# EAGLE design ByteBlasterII (EAGLE 6.6.0)
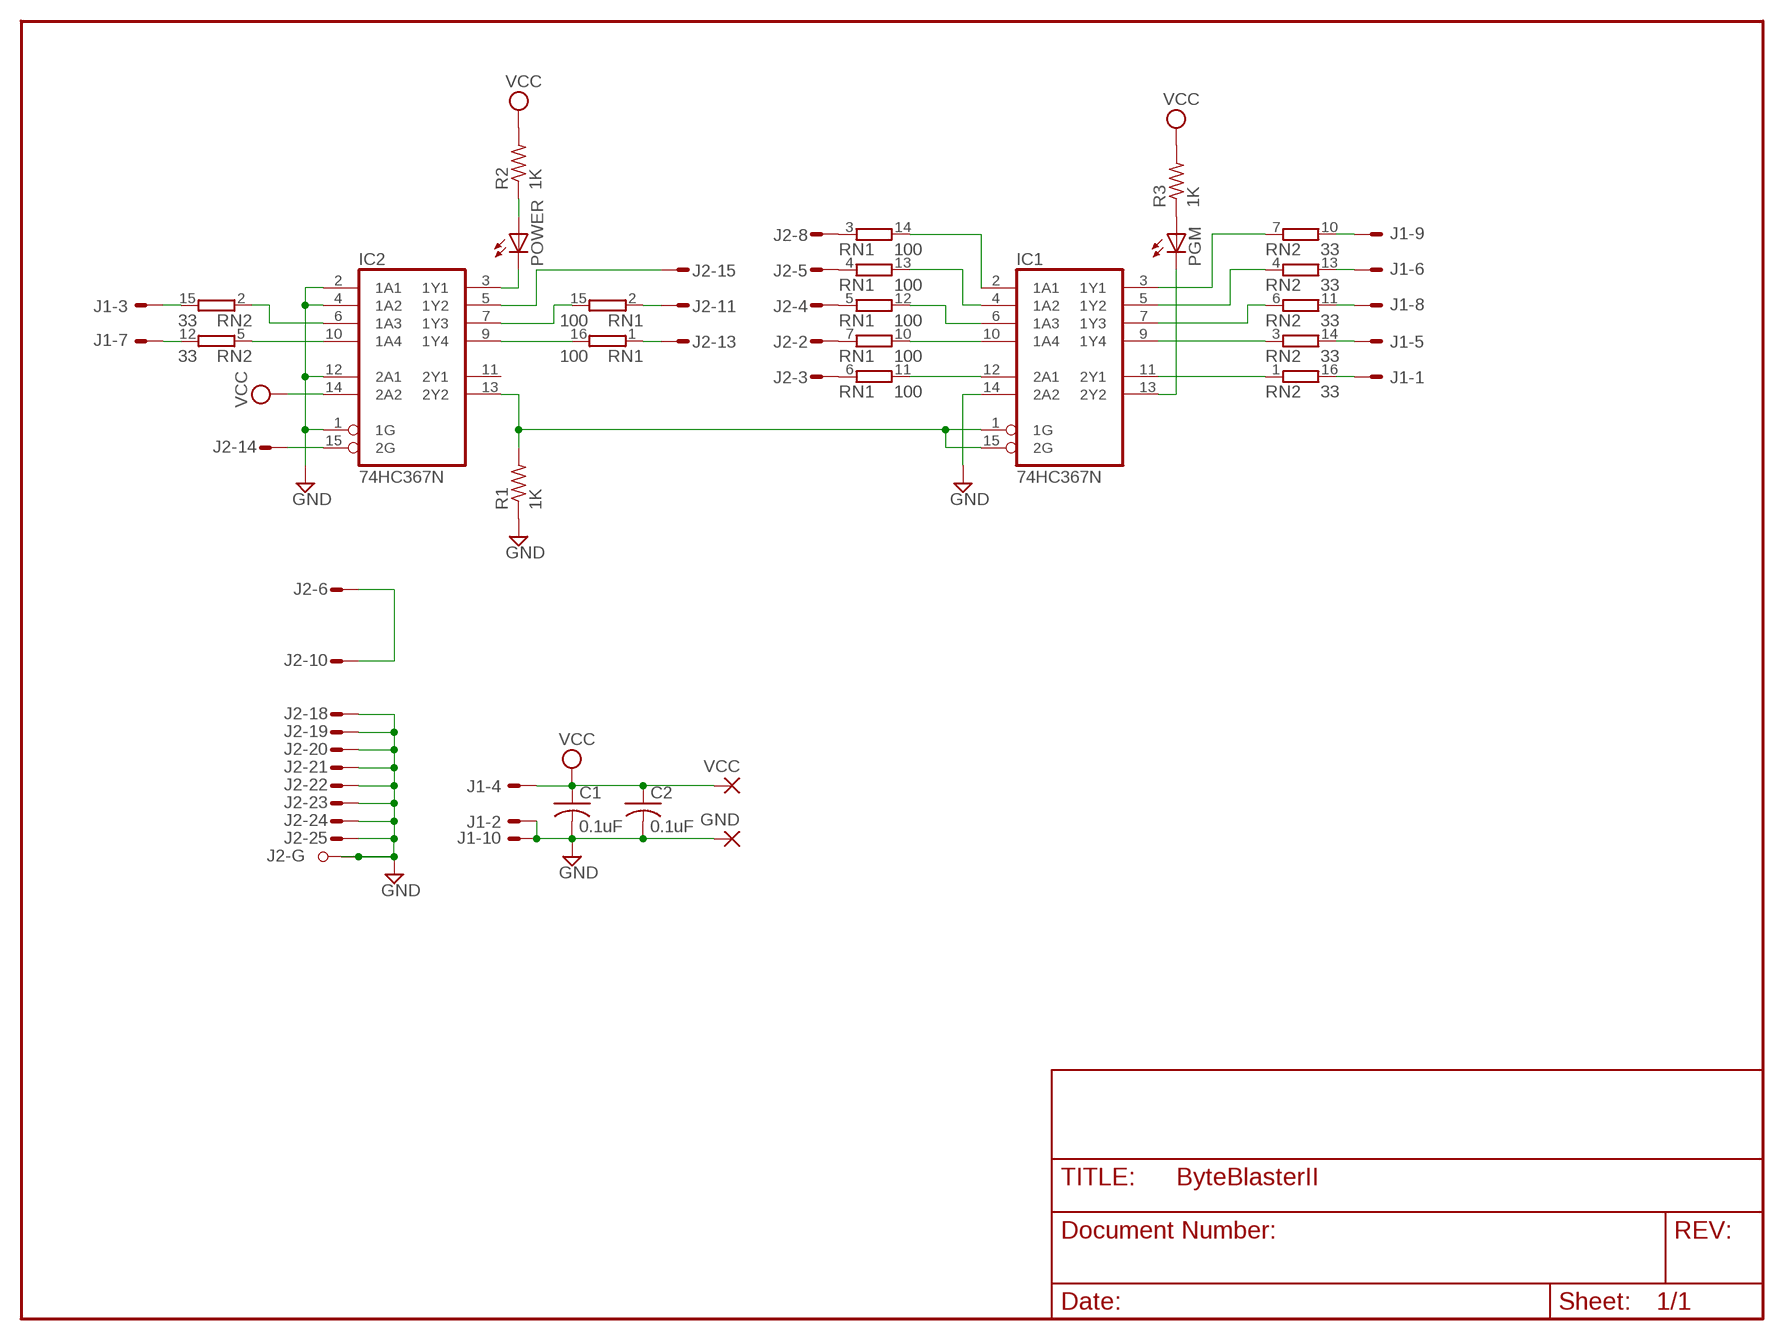
[diagram p0: schematic, sheet 1]

## Parts
C1  0.1uF  C-US050-025X075  [C050-025X075]
C2  0.1uF  C-US050-025X075  [C050-025X075]
GND  1,6/0,9  [1,6/0,9]
IC1  74HC367N  [DIL16]
IC2  74HC367N  [DIL16]
J1  ML10E  [ML10]
J2  M25VPS  [M25VP]
PGM  LED3MM  [LED3MM]
POWER  LED3MM  [LED3MM]
R1  1K  R-US_0207/10  [0207/10]
R2  1K  R-US_0207/10  [0207/10]
R3  1K  R-US_0207/10  [0207/10]
RN1  100  8R-P  [DIL16]
RN2  33  8R-P  [DIL16]
VCC  1,6/0,9  [1,6/0,9]

## Nets
GND [supply]: C1.2 C2.2 GND.1(P) IC1.14(2A2) IC2.1(1G) IC2.2(1A1) IC2.4(1A2) IC2.12(2A1) J1.2 J1.10 J2.18(-18:M) J2.19(-19:M) J2.20(-20:M) J2.21(-21:M) J2.22(-22:M) J2.23(-23:M) J2.24(-24:M) J2.25(-25:M) J2.G1(-G:G1) J2.G2(-G:G2) R1.1
N$1: J1.6 RN2.13
N$2: J1.8 RN2.11
N$3: J2.8(-8:M) RN1.3
N$4: J2.5(-5:M) RN1.4
N$5: J1.5 RN2.14
N$6: J1.9 RN2.10
N$7: J2.4(-4:M) RN1.5
N$8: IC1.10(1A4) RN1.10
N$9: J2.6(-6:M) J2.10(-10:M)
N$10: J2.3(-3:M) RN1.6
N$11: IC1.4(1A2) RN1.13
N$12: J2.13(-13:M) RN1.1
N$13: J1.1 RN2.16
N$14: J2.11(-11:M) RN1.2
N$15: IC1.1(1G) IC1.15(2G) IC2.13(2Y2) R1.2
N$16: IC2.10(1A4) RN2.5
N$17: IC2.5(1Y2) J2.15(-15:M)
N$18: IC2.6(1A3) RN2.2
N$19: IC1.2(1A1) RN1.14
N$20: IC1.6(1A3) RN1.12
N$21: IC1.12(2A1) RN1.11
N$22: IC2.3(1Y1) POWER.K(C)
N$23: J2.2(-2:M) RN1.7
N$24: IC2.9(1Y4) RN1.16
N$25: IC1.11(2Y1) RN2.1
N$26: IC2.7(1Y3) RN1.15
N$27: IC2.15(2G) J2.14(-14:M)
N$28: IC1.9(1Y4) RN2.3
N$29: IC1.7(1Y3) RN2.6
N$30: IC1.5(1Y2) RN2.4
N$31: IC1.3(1Y1) RN2.7
N$32: POWER.A R2.1
N$33: IC1.13(2Y2) PGM.K(C)
N$34: PGM.A R3.1
N$35: J1.3 RN2.15
N$36: J1.7 RN2.12
VCC [supply]: C1.1 C2.1 IC2.14(2A2) J1.4 R2.2 R3.2 VCC.1(P)
Unconnected: IC2.11(2Y1) J2.1(-1:M) J2.7(-7:M) J2.9(-9:M) J2.12(-12:M) J2.16(-16:M) J2.17(-17:M) RN1.8 RN1.9 RN2.8 RN2.9

## Power pins joined to a net without a drawn wire
GND: IC1.8(GND) IC2.8(GND)
VCC: IC1.16(VCC) IC2.16(VCC)

## Library data of the parts
C1 C2 = rcl:C-US: CAPACITOR, American symbol
GND VCC = wirepad:1,6/0,9: THROUGH-HOLE PAD
IC1 IC2 = 74xx-eu:74*367: Hex BUS DRIVER, 3-state
J1 = con-harting-ml:ML10?E: HARTING
J2 = con-subd:M25VPS: SUB-D
PGM POWER = led:LED: LED OSRAM: - CHIPLED LG R971, LG N971, LY N971, LG Q971, LY Q971, LO R971, LY R971 LH N974, LH R974 LS Q976, LO Q976, LY Q976 LO Q996 - Hyper CHIPLED LW Q18S LB Q993, LB Q99A, LB R99A - SideLED LS A670, LO A670, LY A670, LG A670, LP A670 LB A673, LV A673, LT A673, LW A673 LH A674 LY A675 LS A676, LA A676, LO A676, LY A676, LW A676 LS A679, LY A679, LG A679 - Hyper Micro SIDELED® LS Y876, LA Y876, LO Y876, LY Y876 LT Y87S - SmartLED LW L88C, LW L88S LB L89C, LB L89S, LG L890 LS L89K, LO L89K, LY L89K LS L896, LA L896, LO L896, LY L896 - TOPLED LS T670, LO T670, LY T670, LG T670, LP T670 LSG T670, LSP T670, LSY T670, LOP T670, LYG T670 LG T671, LOG T671, LSG T671 LB T673, LV T673, LT T673, LW T673 LH T674 LS T676, LA T676, LO T676, LY T676, LB T676, LH T676, LSB T676, LW T676 LB T67C, LV T67C, LT T67C, LS T67K, LO T67K, LY T67K, LW E67C LS E67B, LA E67B, LO E67B, LY E67B, LB E67C, LV E67C, LT E67C LW T67C LS T679, LY T679, LG T679 LS T770, LO T770, LY T770, LG T770, LP T770 LB T773, LV T773, LT T773, LW T773 LH T774 LS E675, LA E675, LY E675, LS T675 LS T776, LA T776, LO T776, LY T776, LB T776 LHGB T686 LT T68C, LB T68C - Hyper Mini TOPLED® LB M676 - Mini TOPLED Santana® LG M470 LS M47K, LO M47K, LY M47K Source: http://www.osram.convergy.de/
R1-R3 = rcl:R-US_: RESISTOR, American symbol
RN1 RN2 = resistor-dil:8R-P: DIL RESISTOR

## Net classes
1 supply: width 0.813 mm

## Board
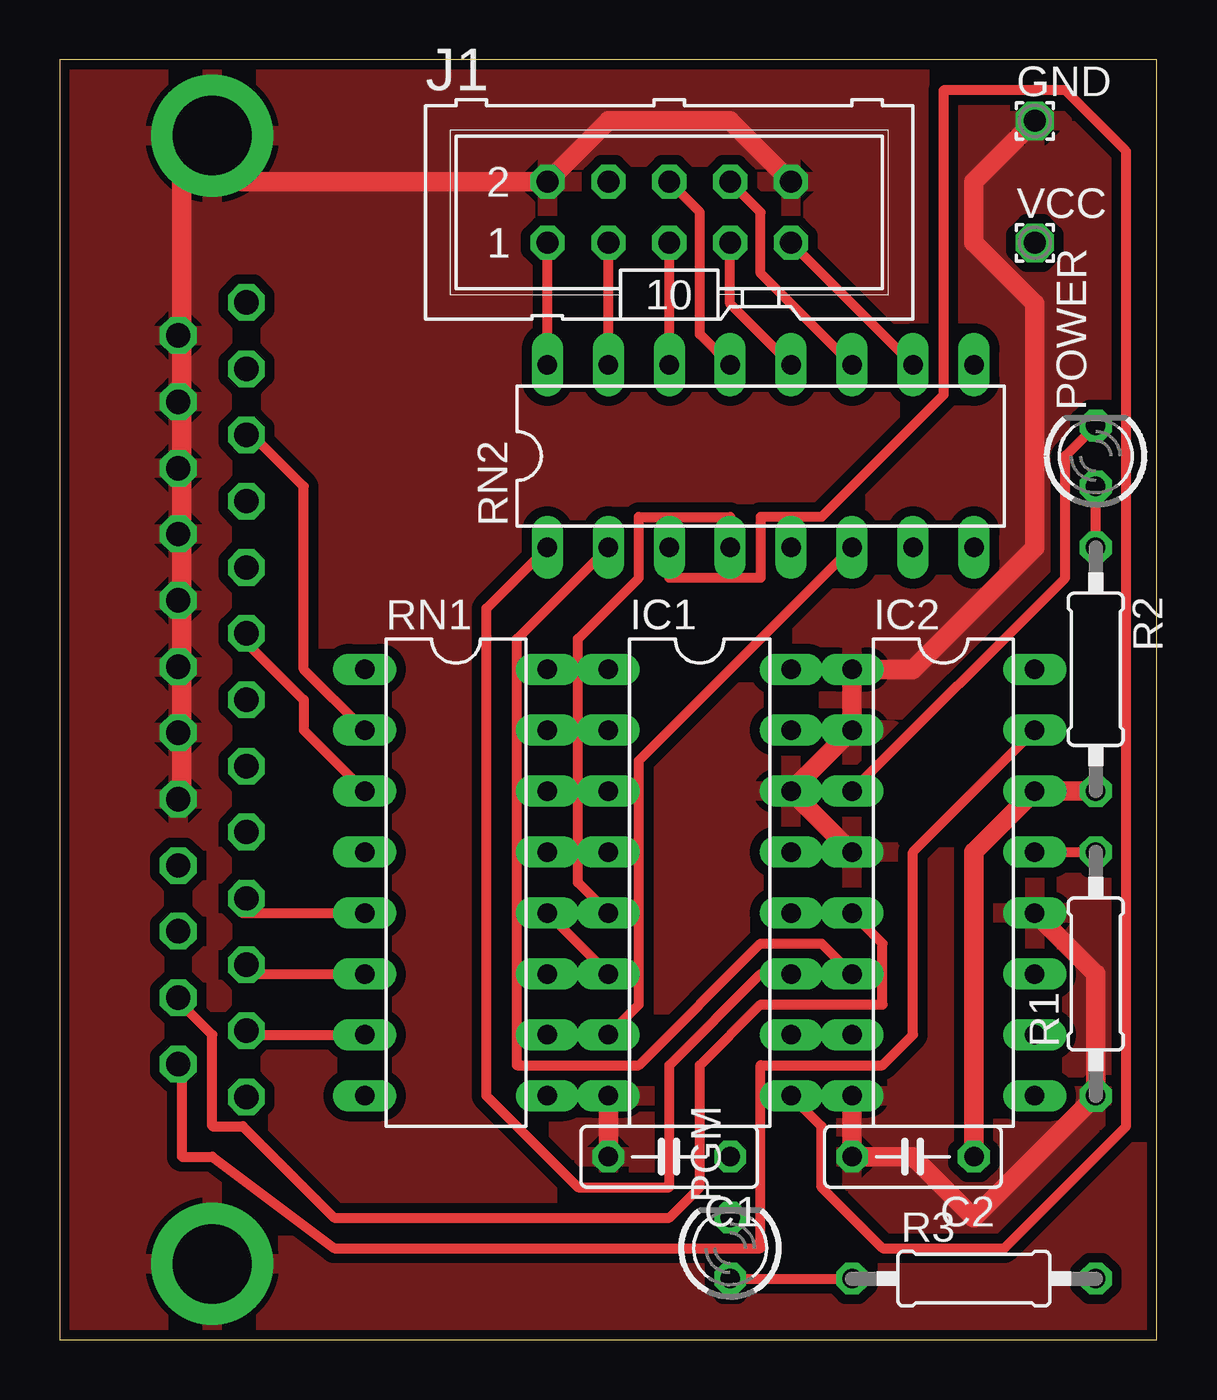
[diagram p1: board, top side]
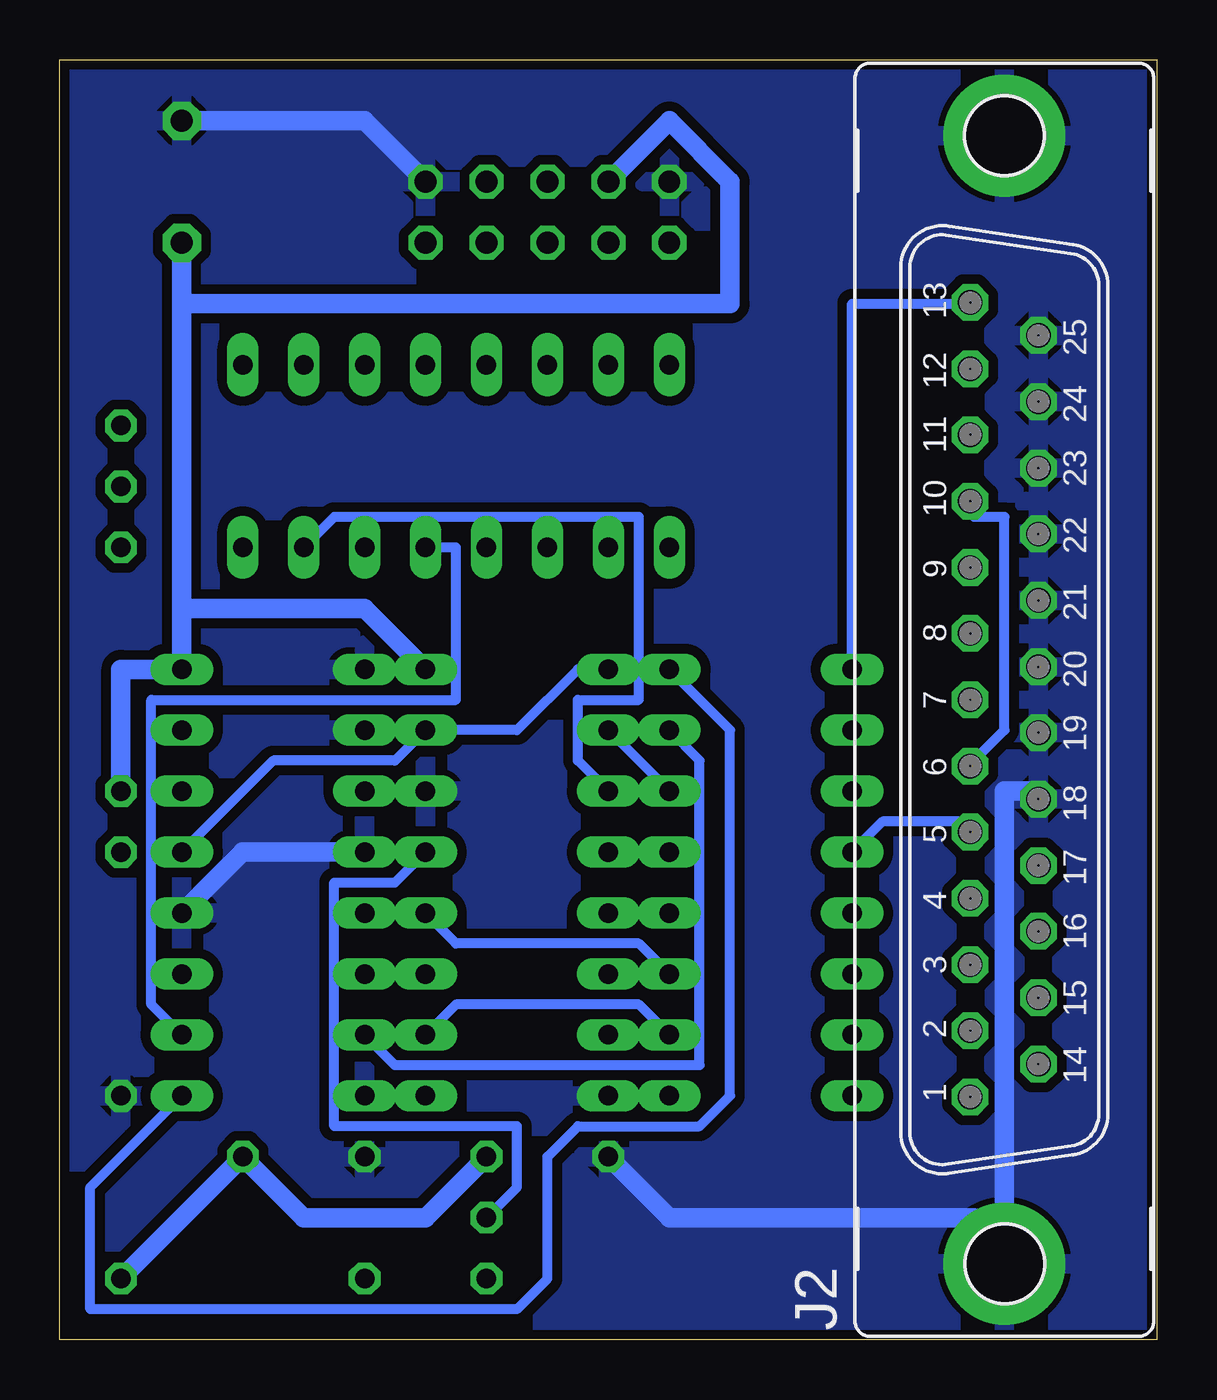
[diagram p2: board, bottom side, seen from below]

Size 45.72 x 53.34 mm. Coordinates in mm from the lower left corner, seen from the top.
Outline: 0,0 45.72,0 45.72,53.34 0,53.34 0,0
Copper layers (1+16): Top 0.035mm / dielectric 1.5mm / Bottom 0.035mm
Design rules "16mils": minimum track width 16mil, minimum drill 32mil, track to track 15mil, track to pad 10mil, pad to pad 10mil, via to via 10mil, smd to smd 10mil, copper to edge 13mil, drill to drill 10mil, minimum pad ring 10mil, minimum via ring 8mil, stop-mask expansion 0mil, vias tented up to drill 0mil, thermal gap 10mil

### Footprints (pad centres in the part's own frame; a part is rotated, then mirrored left to right if it is on the bottom)
C050-025X075 = drill 0.813 octagon: 1 -2.54,0; 2 2.54,0
1,6/0,9 = drill 0.914 pad 1.6 octagon: 1 0,0
DIL16 = drill 0.813 long: 1 -8.89,-3.81; 2 -6.35,-3.81; 3 -3.81,-3.81; 4 -1.27,-3.81; 5 1.27,-3.81; 6 3.81,-3.81; 7 6.35,-3.81; 8 8.89,-3.81; 9 8.89,3.81; 10 6.35,3.81; 11 3.81,3.81; 12 1.27,3.81; 13 -1.27,3.81; 14 -3.81,3.81; 15 -6.35,3.81; 16 -8.89,3.81
ML10 = drill 0.914 octagon: 1 -5.08,-1.27; 2 -5.08,1.27; 3 -2.54,-1.27; 4 -2.54,1.27; 5 0,-1.27; 6 0,1.27; 7 2.54,-1.27; 8 2.54,1.27; 9 5.08,-1.27; 10 5.08,1.27
M25VP = drill 1.016 octagon: 1 -16.561,1.422; 2 -13.792,1.422; 3 -11.049,1.422; 4 -8.28,1.422; 5 -5.512,1.422; 6 -2.769,1.422; 7 0,1.422; 8 2.769,1.422; 9 5.512,1.422; 10 8.28,1.422; 11 11.049,1.422; 12 13.792,1.422; 13 16.561,1.422; 14 -15.189,-1.422; 15 -12.421,-1.422; 16 -9.652,-1.422; 17 -6.909,-1.422; 18 -4.14,-1.422; 19 -1.372,-1.422; 20 1.372,-1.422; 21 4.14,-1.422; 22 6.909,-1.422; 23 9.652,-1.422; 24 12.421,-1.422; 25 15.189,-1.422 | drill 3.302 pad 5.08: G1 -23.52,0; G2 23.52,0
LED3MM = drill 0.813 octagon: A -1.27,0; K 1.27,0
0207/10 = drill 0.813 octagon: 1 -5.08,0; 2 5.08,0

### Placement (x,y rotation side)
C1  25.4,7.62 180 top
C2  35.56,7.62 180 top
GND  40.64,50.8 0 top
IC1  26.67,19.05 270 top
IC2  36.83,19.05 270 top
J1  25.4,46.99 0 top
J2  6.35,26.67 90 bottom
PGM  27.94,3.81 90 top
POWER  43.18,36.83 90 top
R1  43.18,15.24 90 top
R2  43.18,27.94 270 top
R3  38.1,2.54 0 top
RN1  16.51,19.05 270 top
RN2  29.21,36.83 0 top
VCC  40.64,45.72 0 top

### Tracks (layer width: path | path; a pad name or v marks a point on that pad's centre or on a via)
GND
  Top 0.813: C1.2 IC1.8 | IC2.4 IC1.14 IC2.2 IC2.1 35.56,27.94 40.64,33.02 40.64,43.18 38.1,45.72 38.1,48.26 GND.1 | IC2.8 C2.2 35.56,7.62 38.1,5.08 R1.1 43.18,15.24 IC2.12 | 5.08,36.83 5.08,39.37 | 5.08,39.37 5.08,41.91 | 5.08,39.37 J2.24 | 5.08,25.4 5.08,22.86 J2.18 | 5.08,27.94 5.08,30.48 | 5.08,30.48 5.08,33.02 J2.22 5.08,34.29 5.08,36.83 | 5.08,30.48 J2.21 | 5.08,25.4 5.08,27.94 | 5.08,25.4 J2.19 | 5.08,27.94 J2.20 | 5.08,36.83 J2.23 | J1.10 27.94,50.8 22.86,50.8 J1.2 7.62,48.26 J2.G2 5.08,48.26 5.08,41.91 | 5.08,41.91 J2.25
  Bottom 0.813: C1.2 20.32,5.08 7.62,5.08 J2.G1 6.35,22.86 5.08,22.86 J2.18 | IC2.4 38.1,20.32 IC2.12 | J1.10 33.02,50.8 GND.1
  pour Bottom (isolate 0.406): 0,0 0,53.34 45.72,53.34 45.72,0
  pour Top (isolate 0.406): 0,0 0,53.34 45.72,53.34 45.72,0
N$1
  Top 0.406: RN2.13 26.67,41.91 26.67,46.99 J1.6
N$2
  Top 0.406: RN2.11 29.21,44.45 29.21,46.99 J1.8
N$3
  Top 0.406: RN1.3 10.16,25.4 10.16,26.67 7.62,29.21 J2.8
N$4
  Bottom 0.406: RN1.4 11.43,21.59 7.62,21.59 J2.5
N$5
  Top 0.406: RN2.14 J1.5
N$6
  Top 0.406: J1.9 RN2.10
N$7
  Top 0.406: RN1.5 7.62,17.78 J2.4
N$8
  Bottom 0.406: RN1.10 21.59,13.97 29.21,13.97 IC1.10
N$9
  Bottom 0.406: J2.6 7.62,24.13 6.35,25.4 6.35,34.29 7.62,34.29 J2.10
N$10
  Top 0.406: RN1.6 7.62,15.24 J2.3
N$11
  Bottom 0.406: RN1.13 IC1.4
N$12
  Bottom 0.406: RN1.1 12.7,43.18 7.62,43.18 J2.13
N$13
  Top 0.406: RN2.16 J1.1
N$14
  Top 0.406: RN1.2 10.16,27.94 10.16,35.56 7.62,38.1 J2.11
N$15
  Top 0.406: IC2.13 R1.2
  Bottom 0.406: IC1.1 24.13,27.94 26.67,25.4 IC1.15 31.75,24.13 36.83,24.13 IC2.13
N$16
  Bottom 0.406: IC2.10 41.91,13.97 41.91,26.67 29.21,26.67 29.21,33.02 RN2.5
N$17
  Top 0.406: IC2.5 34.29,16.51 34.29,13.97 29.21,13.97 26.67,11.43 26.67,6.35 25.4,5.08 11.43,5.08 7.62,8.89 6.35,8.89 6.35,12.7 5.08,13.97 J2.15
N$18
  Top 0.406: IC2.6 31.75,16.51 29.21,16.51 24.13,11.43 19.05,11.43 19.05,29.21 RN2.2
N$19
  Bottom 0.406: RN1.14 IC1.2
N$20
  Top 0.406: IC1.6 RN1.12
N$21
  Bottom 0.406: RN1.11 21.59,16.51 29.21,16.51 IC1.12
N$22
  Top 0.406: IC2.3 41.91,31.75 41.91,36.83 POWER.K
N$23
  Top 0.406: RN1.7 7.62,12.7 J2.2
N$24
  Bottom 0.406: RN1.16 17.78,25.4 17.78,10.16 19.05,8.89 24.13,8.89 25.4,7.62 25.4,2.54 26.67,1.27 44.45,1.27 44.45,6.35 IC2.9
N$25
  Top 0.406: RN2.1 17.78,30.48 17.78,10.16 21.59,6.35 25.4,6.35 25.4,11.43 29.21,15.24 IC1.11
N$26
  Bottom 0.406: RN1.15 19.05,24.13 19.05,11.43 31.75,11.43 IC2.7
N$27
  Top 0.406: IC2.15 35.56,20.32 35.56,12.7 34.29,11.43 29.21,11.43 29.21,3.81 11.43,3.81 6.35,7.62 5.08,7.62 5.08,11.43 J2.14
N$28
  Top 0.406: IC1.9 31.75,8.89 31.75,6.35 34.29,3.81 39.37,3.81 44.45,8.89 44.45,49.53 41.91,52.07 36.83,52.07 36.83,39.37 31.75,34.29 29.21,34.29 29.21,31.75 25.4,31.75 RN2.3
N$29
  Top 0.406: IC1.7 24.13,13.97 24.13,24.13 RN2.6
N$30
  Top 0.406: IC1.5 21.59,19.05 21.59,29.21 24.13,31.75 24.13,34.29 27.94,34.29 RN2.4
N$31
  Bottom 0.406: IC1.3 24.13,24.13 24.13,26.67 21.59,26.67 21.59,34.29 34.29,34.29 RN2.7
N$32
  Top 0.406: R2.1 POWER.A
N$33
  Bottom 0.406: PGM.K 26.67,6.35 26.67,8.89 34.29,8.89 34.29,19.05 31.75,19.05 IC1.13
N$34
  Top 0.406: PGM.A R3.1
N$35
  Top 0.406: RN2.15 J1.3
N$36
  Top 0.406: RN2.12 27.94,43.18 J1.7
VCC
  Top 0.813: R2.2 IC2.14 38.1,20.32 C2.1
  Bottom 0.813: IC1.16 33.02,30.48 38.1,30.48 40.64,30.48 | 40.64,30.48 IC2.16 43.18,27.94 R2.2 | C1.1 30.48,5.08 35.56,5.08 C2.1 R3.2 | 40.64,30.48 40.64,43.18 | 40.64,43.18 VCC.1 | J1.4 20.32,50.8 17.78,48.26 17.78,43.18 40.64,43.18